# EAGLE design PCSoposeLM (EAGLE 9.6.2)

## Sheet 1 of 2
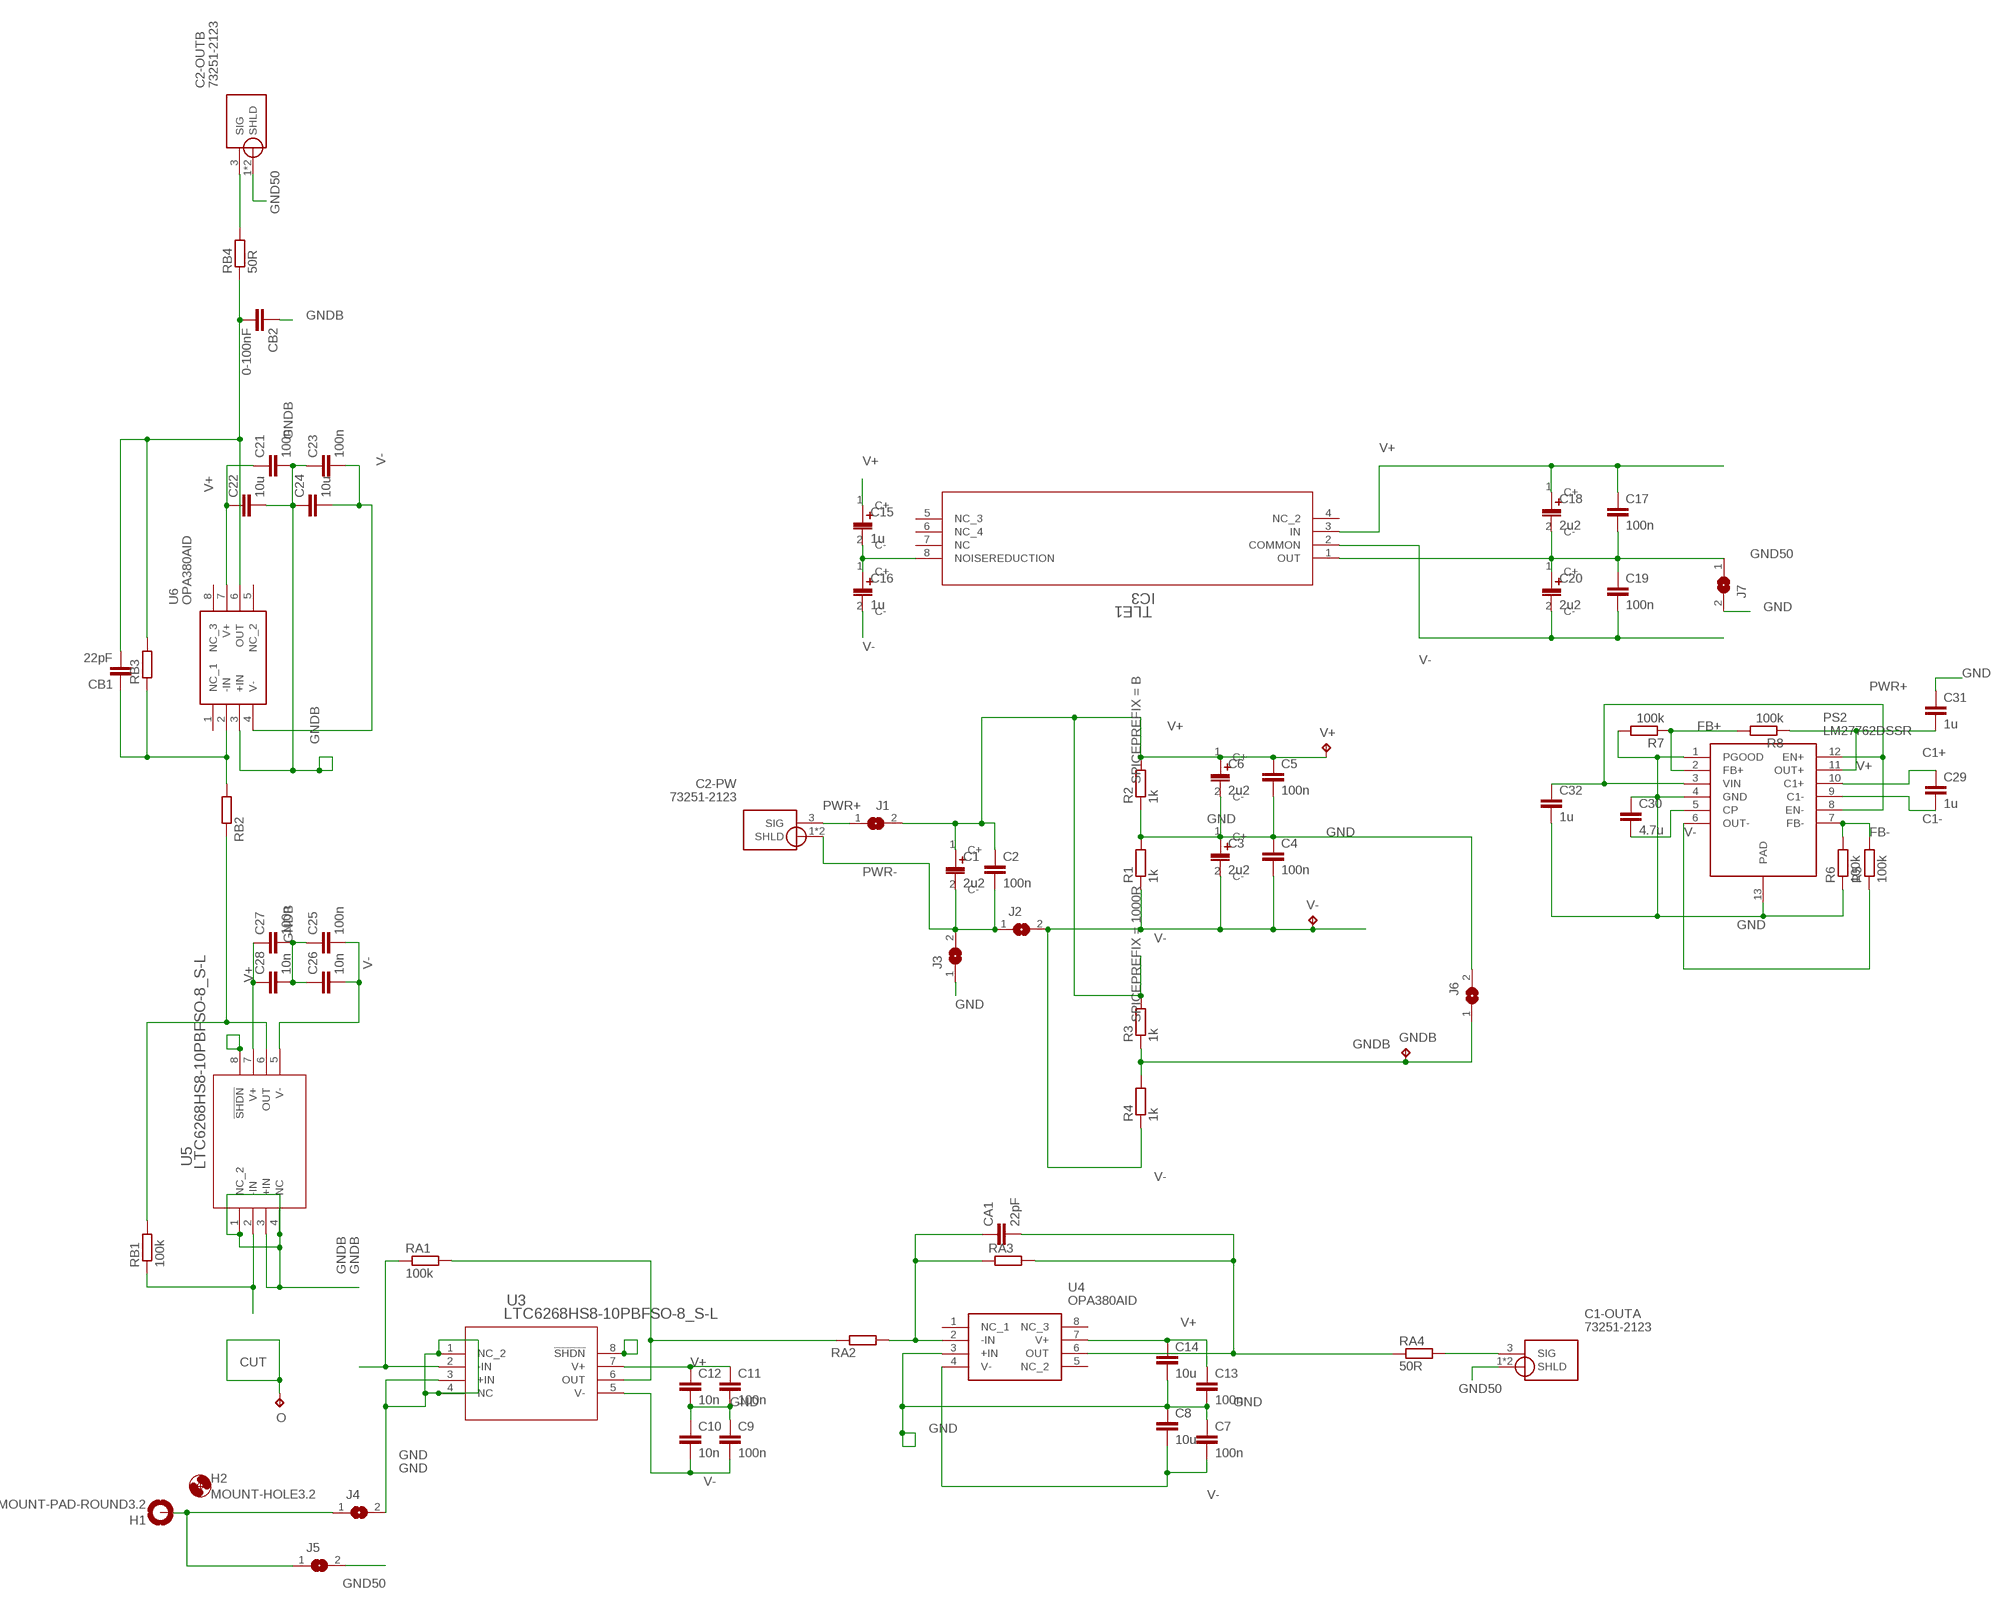
[diagram p0: schematic, sheet 1]

### Parts
C1  2u2  C-EU_POL  [C1206K]
C1-OUTA  73251-2123  [73251-2123]
C2  100n  C-EUC1206K  [C1206K]
C2-OUTB  73251-2123  [73251-2123]
C2-PW  73251-2123  [73251-2123]
C3  2u2  C-EU_POL  [C1206K]
C4  100n  C-EUC1206K  [C1206K]
C5  100n  C-EUC1206K  [C1206K]
C6  2u2  C-EU_POL  [C1206K]
C7  100n  C-EUC1206K  [C1206K]
C8  10u  C-EUC1206K  [C1206K]
C9  100n  C-EUC1206K  [C1206K]
C10  10n  C-EUC1206K  [C1206K]
C11  100n  C-EUC1206K  [C1206K]
C12  10n  C-EUC1206K  [C1206K]
C13  100n  C-EUC1206K  [C1206K]
C14  10u  C-EUC1206K  [C1206K]
C15  1u  C-EU_POL  [C1206K]
C16  1u  C-EU_POL  [C1206K]
C17  100n  C-EUC1206K  [C1206K]
C18  2u2  C-EU_POL  [C1206K]
C19  100n  C-EUC1206K  [C1206K]
C20  2u2  C-EU_POL  [C1206K]
C21  100n  C-EUC1206K  [C1206K]
C22  10u  C-EUC1206K  [C1206K]
C23  100n  C-EUC1206K  [C1206K]
C24  10u  C-EUC1206K  [C1206K]
C25  100n  C-EUC1206K  [C1206K]
C26  10n  C-EUC1206K  [C1206K]
C27  100n  C-EUC1206K  [C1206K]
C28  10n  C-EUC1206K  [C1206K]
C29  1u  C-EUC1206K  [C1206K]
C30  4.7u  C-EUC1206K  [C1206K]
C31  1u  C-EUC1206K  [C1206K]
C32  1u  C-EUC1206K  [C1206K]
CA1  22pF  C-EUC1206K  [C1206K]
CB1  22pF  C-EUC1206K  [C1206K]
CB2  0-100nF  C-EUC1206K  [C1206K]
GNDB  TPB2,54  [B2,54]
H1  MOUNT-PAD-ROUND3.2  [3,2-PAD]
H2  MOUNT-HOLE3.2  [3,2]
J1  SJ  [SJ]
J2  SJ  [SJ]
J3  SJ  [SJ]
J4  SJ  [SJ]
J5  SJ  [SJ]
J6  SJ  [SJ]
J7  SJ  [SJ]
O  TPTP06R  [TP06R]
PS2  LM27762DSSR  [SON50P200X300X80-13N]
R1  1k  R-EU_R1206  [R1206]
R2  1k  R-EU_R1206  [R1206]
R3  1k  R-EU_R1206  [R1206]
R4  1k  R-EU_R1206  [R1206]
R5  100k  R-EU_R0805  [R0805]
R6  100k  R-EU_R0805  [R0805]
R7  100k  R-EU_R0805  [R0805]
R8  100k  R-EU_R0805  [R0805]
RA1  100k  R-EU_R1206  [R1206]
RA2  R-EU_R1206  [R1206]
RA3  R-EU_R1206  [R1206]
RA4  50R  R-EU_R1206  [R1206]
RB1  100k  R-EU_R1206  [R1206]
RB2  R-EU_R1206  [R1206]
RB3  R-EU_R1206  [R1206]
RB4  50R  R-EU_R1206  [R1206]
TLE1  IC3  TLE2426CDD8-M  [D8-M]
U3  LTC6268HS8-10PBFSO-8_S-L  [SO-8_S-L]
U4  OPA380AID  [SOIC127P600X175-8N]
U5  LTC6268HS8-10PBFSO-8_S-L  [SO-8_S-L]
U6  OPA380AID  [SOIC127P600X175-8N]
V+  TPB2,54  [B2,54]
V-  TPB2,54  [B2,54]

### Nets
C1+: C29.1 PS2.10(C1+)
C1-: C29.2 PS2.9(C1-)
CUT: O.TP
EXTGND: H1.B3,2(MOUNT) J4.1 J5.1
FB+: PS2.2(FB+) R7.1 R8.2
FB-: PS2.7(FB-) R5.2 R6.2
GND [Supply]: C3.1(C+) C4.1 C5.2 C6.2(C-) C7.1 C8.1 C9.1 C10.1 C11.2 C12.2 C13.2 C14.2 C30.1 C31.1 C32.2 J3.1 J4.2 J6.2 J7.2 PS2.1(PGOOD) PS2.4(GND) PS2.13(PAD) R1.2 R2.1 R6.1 R7.2 U3.1(NC_2) U3.3(+IN) U3.4(NC) U4.3(+IN)
GND50 [Signal]: C1-OUTA.1(SHLD) C1-OUTA.2(SHLD) C2-OUTB.1(SHLD) C2-OUTB.2(SHLD) C17.2 C18.2(C-) C19.1 C20.1(C+) J5.2 J7.1 TLE1.1(OUT)
GNDB [Supply]: C21.2 C22.2 C23.1 C24.1 C25.1 C26.1 C27.2 C28.2 CB2.1 GNDB.TP J6.1 R3.1 R4.2 U5.1(NC_2) U5.3(+IN) U5.4(NC) U6.3(+IN)
INA [Signal]: RA1.1 U3.2(-IN)
INB [Signal]: RB1.1 U5.2(-IN)
N$1: U3.8(!SHDN)
N$4: C15.2(C-) C16.1(C+) TLE1.8(NOISEREDUCTION)
N$8 [Signal]: RA1.2 RA2.2 U3.6(OUT)
N$9: C30.2 PS2.5(CP)
N$10 [Signal]: CA1.1 RA2.1 RA3.1 U4.2(-IN)
N$11 [Signal]: CA1.2 RA3.2 RA4.1 U4.6(OUT)
N$12 [50Ohm TOP-L2]: C1-OUTA.3(SIG) RA4.2
N$16 [Signal]: RB1.2 RB2.2 U5.6(OUT)
N$18 [Signal]: CB1.1 RB2.1 RB3.1 U6.2(-IN)
N$19 [Signal]: CB1.2 CB2.2 RB3.2 RB4.1 U6.6(OUT)
N$20 [50Ohm TOP-L2]: C2-OUTB.3(SIG) RB4.2
N$21: U5.8(!SHDN)
PWR+ [Supply]: C2-PW.3(SIG) C32.1 J1.1 PS2.3(VIN) PS2.8(EN-) PS2.12(EN+)
PWR-: C1.2(C-) C2-PW.1(SHLD) C2-PW.2(SHLD) C2.2 J2.1 J3.2
V+ [Supply]: C1.1(C+) C2.1 C5.1 C6.1(C+) C11.1 C12.1 C13.1 C14.1 C15.1(C+) C17.1 C18.1(C+) C21.1 C22.1 C27.1 C28.1 C31.2 J1.2 PS2.11(OUT+) R2.2 R3.2 R8.1 TLE1.3(IN) U3.7(V+) U4.7(V+) U5.7(V+) U6.7(V+) V+.TP
V- [Supply]: C3.2(C-) C4.2 C7.2 C8.2 C9.2 C10.2 C16.2(C-) C19.2 C20.2(C-) C23.2 C24.2 C25.2 C26.2 J2.2 PS2.6(OUT-) R1.1 R4.1 R5.1 TLE1.2(COMMON) U3.5(V-) U4.4(V-) U5.5(V-) U6.4(V-) V-.TP
Unconnected: TLE1.4(NC_2) TLE1.5(NC_3) TLE1.6(NC_4) TLE1.7(NC) U4.1(NC_1) U4.5(NC_2) U4.8(NC_3) U6.1(NC_1) U6.5(NC_2) U6.8(NC_3)

## Sheet 2 of 2

## Library data of the parts
C1 C3 C6 C15 C16 C18 C20 = SMA-NEU:C-EU_POL; SPICEPREFIX: C
C1-OUTA C2-OUTB C2-PW = SMA-NEU:73251-2123: SMA Jack PCB Edge Mount 50 no hardware Molex Straight 50 Edge Mount Bulkhead Fitting SMA Connector, jack, Solder Termination Source: Datasheet <http://uk.rs-online.com/web/p/products/8006949>; DESCRIPTION: SMA Jack PCB Edge Mount 50 no hardware Molex Straight 50 Edge Mount Bulkhead Fitting SMA Connector, jack, Solder Termination; HEIGHT: mm; MANUFACTURER_NAME: Molex; MANUFACTURER_PART_NUMBER: 73251-2123; RS_PART_NUMBER: 8006949; RS_PRICE-STOCK: http://uk.rs-online.com/web/p/products/8006949
C2 C4 C5 C7-C14 C17 C19 C21-C32 CA1 CB1 CB2 = rcl:C-EU: CAPACITOR, European symbol; SPICEPREFIX: C
GNDB O = testpad:TP: Test pad
H1 = holes:MOUNT-PAD-ROUND: MOUNTING PAD, round
H2 = holes:MOUNT-HOLE: MOUNTING HOLE with drill center marker
J1-J7 = jumper:SJ: SMD solder JUMPER
PS2 = SamacSys_Parts:LM27762DSSR: LDO Voltage Regulators Low-Noise Positive- and Negative-Output Integrated Switched Capacitor Plus LDO 12-WSON -40 to 85 Source: Datasheet <https://www.ti.com/lit/ds/symlink/lm27762.pdf>; DESCRIPTION: LDO Voltage Regulators Low-Noise Positive- and Negative-Output Integrated Switched Capacitor Plus LDO 12-WSON -40 to 85; HEIGHT: 0.8mm; MANUFACTURER_NAME: Texas Instruments; MANUFACTURER_PART_NUMBER: LM27762DSSR; MOUSER_PART_NUMBER: 595-LM27762DSSR; MOUSER_PRICE-STOCK: https://www.mouser.co.uk/ProductDetail/Texas-Instruments/LM27762DSSR?qs=vcbl%252BK4rRlfEJcC9xQ80sA%3D%3D
R1 R2 = rcl:R-EU_: RESISTOR, European symbol; SPICEPREFIX: B
R3 R4 = rcl:R-EU_: RESISTOR, European symbol; SPICEPREFIX: 1000R
R5-R8 RA1-RA4 RB1-RB4 = rcl:R-EU_: RESISTOR, European symbol; SPICEPREFIX: R
TLE1 = TLE2426CD:TLE2426CD; COPYRIGHT: Copyright (C) 2023 Ultra Librarian. All rights reserved.; MANUFACTURER_PART_NUMBER: TLE2426CD; MFR_NAME: Texas Instruments
U3 U5 = LTC6268:LTC6268HS8-10PBF; MANUFACTURER_PART_NUMBER: ltc6268hs8-10#pbf; VENDOR: Linear Technology
U4 U6 = SamacSys_Parts:OPA380AID: Texas Instruments OPA380AID, Transimpedance Amplifier 3 V, 5 V 90MHz 8-Pin SOIC Source: Datasheet <http://uk.rs-online.com/web/p/products/6612498P>; DESCRIPTION: Texas Instruments OPA380AID, Transimpedance Amplifier 3 V, 5 V 90MHz 8-Pin SOIC; HEIGHT: 1.75mm; MANUFACTURER_NAME: Texas Instruments; MANUFACTURER_PART_NUMBER: OPA380AID; RS_PART_NUMBER: 6612498P; RS_PRICE-STOCK: http://uk.rs-online.com/web/p/products/6612498P
V+ V- = testpad:TP: Test pad; SPICEPREFIX: X

## Net classes
0 default: width 0.254 mm, clearance 0.205 mm
1 Supply: width 0.254 mm, clearance 0.205 mm to class 0, clearance 0.205 mm
2 Signal: width 0.254 mm, clearance 0.381 mm to class 0, clearance 0.381 mm to class 1, clearance 0.381 mm
3 50Ohm TOP-L2: width 0.245 mm, clearance 1 mm to class 0, clearance 2 mm to class 1, clearance 1 mm to class 2, clearance 1 mm

## Board
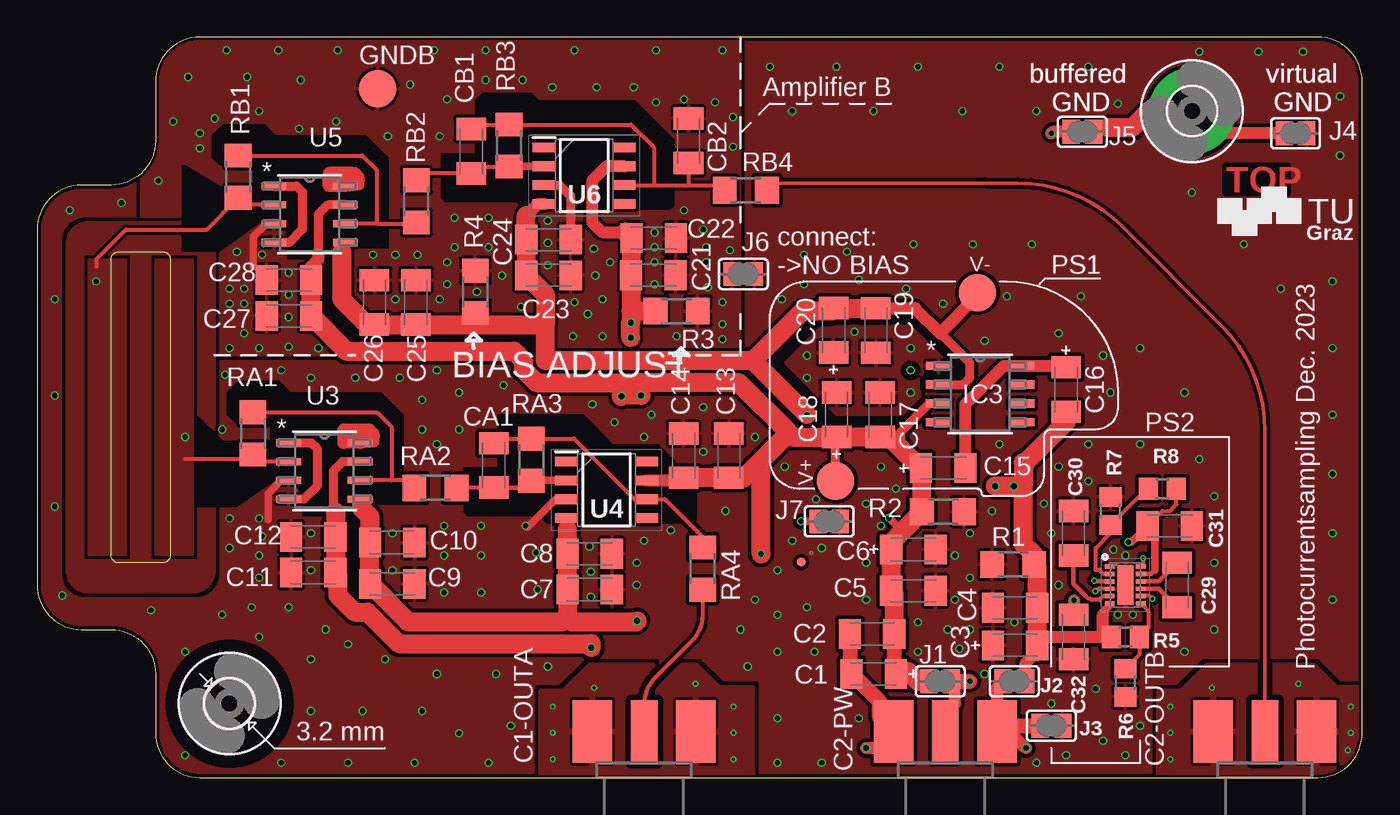
[diagram p1: board, top side]
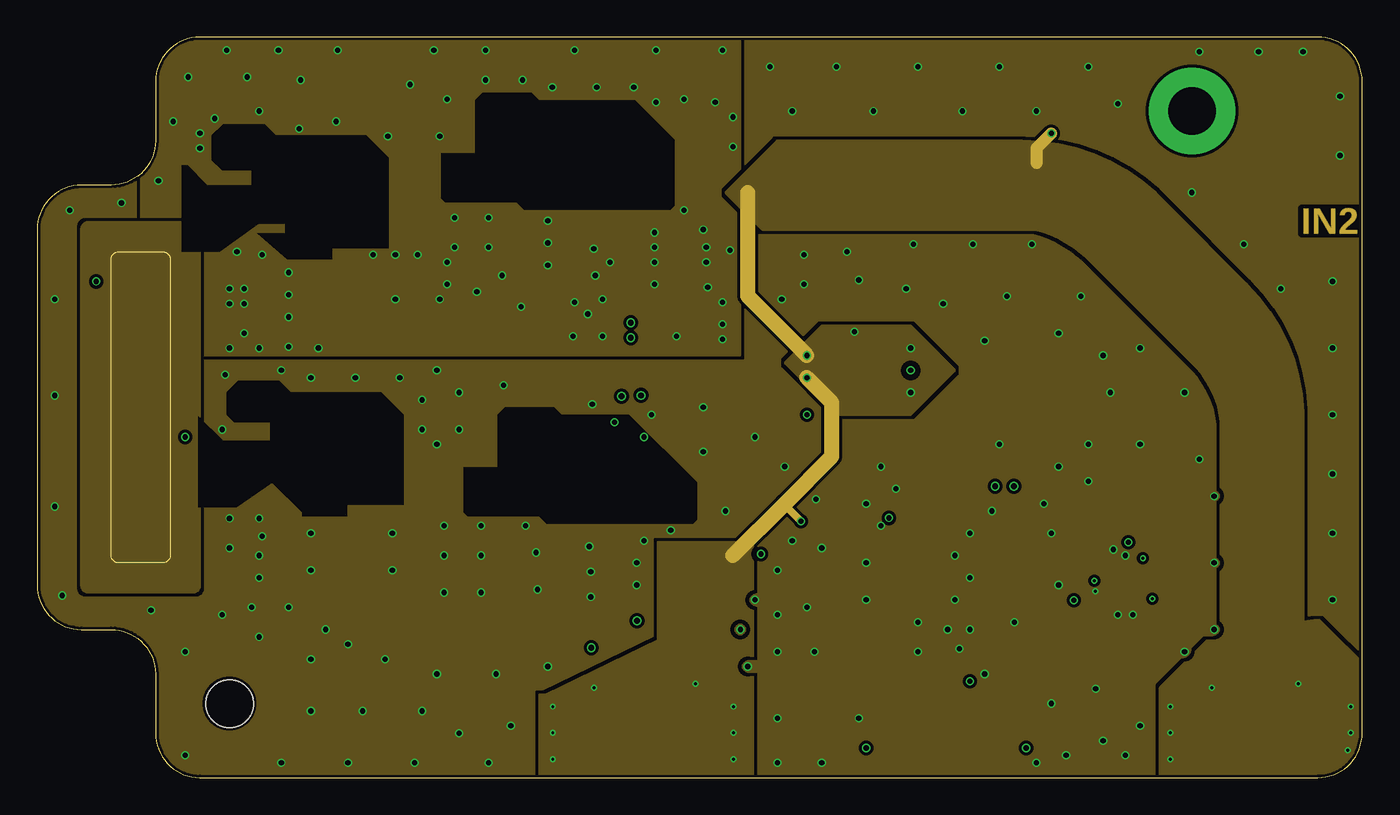
[diagram p2: board, inner layer Route2]
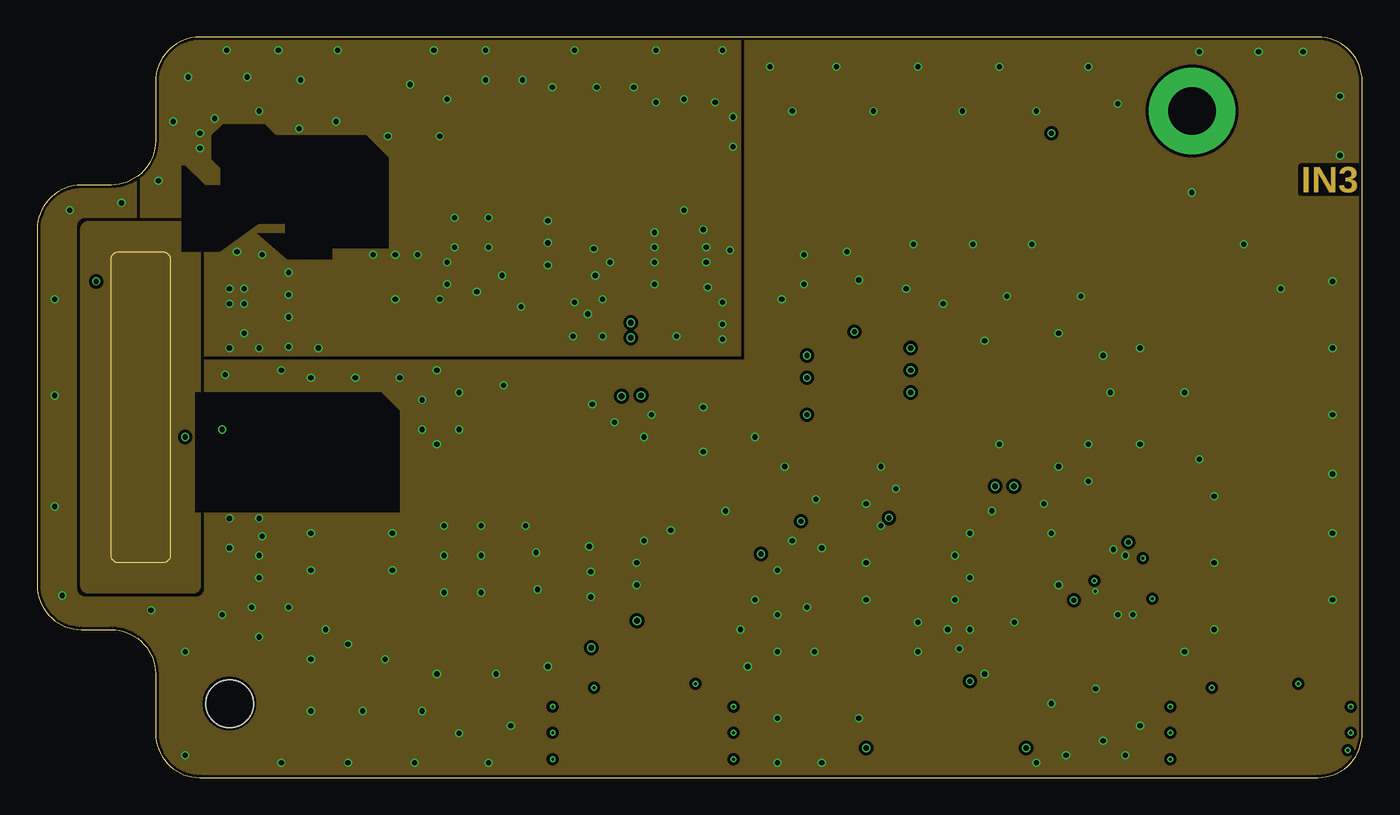
[diagram p3: board, inner layer Route3]
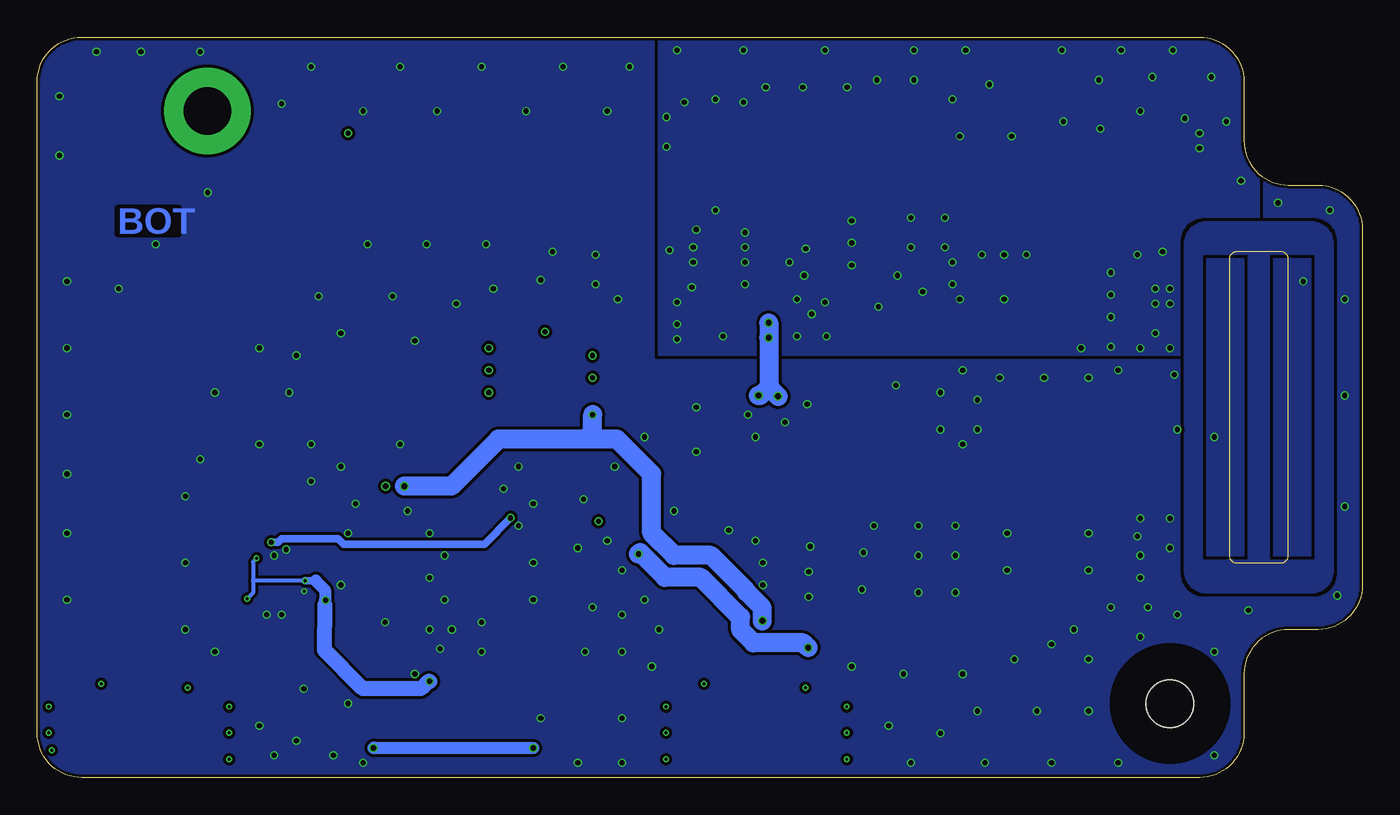
[diagram p4: board, bottom side, seen from below]

Size 89.5 x 50 mm. Coordinates in mm from the lower left corner, seen from the top.
Outline: 8,7 8,3 arc90 11,0 86.5,0 arc90 89.5,3 89.5,47 arc90 86.5,50 11,50 arc90 8,47 8,43 arc-90 5,40 3,40 arc90 0,37 0,13 arc90 3,10 5,10 arc-90 8,7
Copper layers (1+2*3+16): Top 0.018mm / dielectric 0.36mm / Route2 0.035mm / dielectric 0.71mm / Route3 0.035mm / dielectric 0.36mm / Bottom 0.018mm
Design rules "Multi-CB_4L_100µm-Tracks_OL35µm-IL35µm *": minimum track width 0.1mm, minimum drill 0.2mm, track to track 0.1mm, track to pad 0.1mm, pad to pad 0.1mm, via to via 0.1mm, smd to smd 0mil, copper to edge 0.2mm, drill to drill 0.2mm, minimum pad ring 0.125mm, minimum via ring 0.1mm, stop-mask expansion 2mil, vias tented up to drill 0.45mm, thermal gap 0.2mm
Milling: 8 lines

### Footprints (pad centres in the part's own frame; a part is rotated, then mirrored left to right if it is on the bottom)
C1206K = smd 1.5 x 2: 1 -1.5,0; 2 1.5,0
73251-2123 = smd 2.665 x 4.19: 1 -3.493,-3.115; 2 3.493,-3.115 | smd 1.78 x 4.19: 3 0,-3.115
B2,54 = smd 2.54 x 2.54: TP 0,0
3,2-PAD = drill 3.2 pad 5.842: B3,2 0,0
3,2 = hole 3.2: 0,0
SJ = smd 1.168 x 1.6: 1 -0.762,0; 2 0.762,0
TP06R = smd 0.6 x 0.6: TP 0,0
SON50P200X300X80-13N = smd 0.65 x 0.3: 1 -1.05,1.25; 2 -1.05,0.75; 3 -1.05,0.25; 4 -1.05,-0.25; 5 -1.05,-0.75; 6 -1.05,-1.25; 7 1.05,-1.25; 8 1.05,-0.75; 9 1.05,-0.25; 10 1.05,0.25; 11 1.05,0.75; 12 1.05,1.25 | smd 1.1 x 2.66: 13 0,0
R1206 = smd 1.6 x 1.803: 1 -1.422,0; 2 1.422,0
R0805 = smd 1.3 x 1.5: 1 -0.95,0; 2 0.95,0
D8-M = smd 1.664 x 0.559: 1 -2.826,1.905; 2 -2.826,0.635; 3 -2.826,-0.635; 4 -2.826,-1.905; 5 2.826,-1.905; 6 2.826,-0.635; 7 2.826,0.635; 8 2.826,1.905
SO-8_S-L = smd 1.676 x 0.483: 1 -2.413,1.905; 2 -2.413,0.635; 3 -2.413,-0.635; 4 -2.413,-1.905; 5 2.413,-1.905; 6 2.413,-0.635; 7 2.413,0.635; 8 2.413,1.905
SOIC127P600X175-8N = smd 1.528 x 0.65: 1 -2.711,1.905; 2 -2.711,0.635; 3 -2.711,-0.635; 4 -2.711,-1.905; 5 2.711,-1.905; 6 2.711,-0.635; 7 2.711,0.635; 8 2.711,1.905

### Placement (x,y rotation side)
C1  56.5,7 180 top
C1-OUTA  41,0 180 top
C2  56.4,9.69 180 top
C2-OUTB  82.93,0 180 top
C2-PW  61.34,0 180 top
C3  66.05,8.93 0 top
C4  66.05,11.47 0 top
C5  59.19,12.61 0 top
C6  59.19,15.41 0 top
C7  37.32,12.7 180 top
C8  37.32,15.11 180 top
C9  23.99,13.08 180 top
C10  23.99,15.87 180 top
C11  18.65,13.84 180 top
C12  18.65,16.25 180 top
C13  46.73,21.74 90 top
C14  43.67,21.74 90 top
C15  61.2,20.9 0 top
C16  69.5,26.2 270 top
C17  56.94,24.49 90 top
C18  54,24.5 90 top
C19  56.65,30.19 90 top
C20  53.8,30.2 90 top
C21  41.62,33.92 0 top
C22  41.66,36.42 0 top
C23  34.54,33.91 180 top
C24  34.54,36.32 180 top
C25  25.59,32.09 270 top
C26  22.8,32.09 270 top
C27  17.02,31.17 180 top
C28  17.02,33.59 180 top
C29  77,13 270 top
C30  70,16.5 270 top
C31  76.5,17 180 top
C32  70,9.5 270 top
CA1  30.85,21.08 90 top
CB1  29.34,42.29 90 top
CB2  44,43 270 top
GNDB  23,46.5 0 top
H1  78,45 0 top
H2  13,5 0 top
J1  61,6.5 180 top
J2  66,6.5 0 top
J3  68.5,3.5 180 top
J4  85,43.5 0 top
J5  70.6,43.6 180 top
J6  47.7,34 0 top
J7  53.5,17.3 0 top
O  51.6,14.55 270 top
PS2  73.5,13 0 top
R1  65.92,14.39 180 top
R2  61.19,17.95 180 top
R3  43.2,31.5 180 top
R4  29.6,32.8 90 top
R5  73.5,9.5 0 top
R6  73.5,6.4 90 top
R7  72.5,18 90 top
R8  76,19.5 180 top
RA1  14.59,23.24 90 top
RA2  26.91,19.56 180 top
RA3  33.39,21.46 90 top
RA4  44.95,14.11 270 top
RB1  13.59,40.57 90 top
RB2  25.61,38.91 270 top
RB3  31.88,42.67 90 top
RB4  47.88,39.66 0 top
TLE1  63.69,25.9 0 top
U3  19.42,20.7 0 top
U4  38.47,19.43 0 top
U5  18.42,38.03 0 top
U6  36.96,40.64 0 top
V+  53.94,20.03 270 top
V-  63.53,32.74 270 top

### Tracks (layer width: path | path; a pad name or v marks a point on that pad's centre or on a via)
C1+
  Top 0.305: PS2.10 75.75,13.25 C29.1
C1-
  Top 0.254: PS2.9 74.55,12.77
  Top 0.305: PS2.9 75.75,12.75 C29.2
CUT
  pour Top (rank 2): 3.5,37.5 10.5,37.5 arc-90 12,36 12,14 arc-90 10.5,12.5 3.5,12.5 arc-90 2,14 2,36 arc-90
  pour Route2: 3.5,37.5 10.5,37.5 arc-90 11,37 11,13 arc-90 10.5,12.5 3.5,12.5 arc-90 3,13 3,37 arc-90
  pour Route3 (rank 2): 3.5,37.5 10.5,37.5 arc-90 11,37 11,13 arc-90 10.5,12.5 3.5,12.5 arc-90 3,13 3,37 arc-90
  pour Bottom (rank 2): 3.5,37.5 10.5,37.5 arc-90 12,36 12,14 arc-90 10.5,12.5 3.5,12.5 arc-90 2,14 2,36 arc-90
EXTGND
  Top 0.813: 72.31,43.88 71.65,43.88 J5.1 | J4.1 79.5,43.5
  Top 1.27: 72.31,43.88 73.96,43.88 75.08,45 H1.B3,2 79.5,43.5
FB+
  Top 0.254: PS2.2 72.05,13.75 72.03,13.77 71.99,13.77 71.75,14.01 71.5,14.01 71.5,15.5 72.5,16.5 R7.1 74.95,19.5 R8.2
FB-
  Top 0.254: PS2.7 75.05,11.25 75.05,10.1 R5.2 74.45,8.3 R6.2
GND  (via drill 0.2, 0.35)
  Top 0.254: PS2.4 71.65,12.75 v71.48,12.58
  Top 0.508: 15.61,17.4 15.61,19.18 16.49,20.07 U3.3 | 33.13,16.89 35.04,18.8 U4.3
  Top 0.61: U3.1 18.53,22.61 18.91,22.22 18.91,19.68 18.02,18.8 U3.4
  other vias: 51,45 57,21 12.5,11 30,15 14.5,11.5 63,16.5 18.5,27 26,25.5 27,22.5 28.5,26 31.5,26.5 37.5,25.2 41.5,24.5 52.6,18.8 56,18.5 50,14 53,15.5 58,19.5 56,14.5 56,12 57,17 52.5,8.5 40.5,14.5 41,16 40.5,13 42.8,16.7 27.5,12.5 27.5,15 27.5,17 30,17 30,12.5 33.8,12.7 33.7,15.2 33,17 15.2,16.3 13,15.5 23.5,8 15,15 15,13.5 17,11.5 21,9 15,9.5 25.5,1 26,4.5 21,1 10,1.5 10,8.5 18.5,8 13,17.5 54,48 56.5,45 59.5,48 65,48 71,48 78.5,49 82.5,49 85.5,49 62.5,45 67.5,45 73,45.5 64.5,18 62,15 63,13.5 62,12 63,10 59.5,10.5 61.5,10 62.3,8.7 64,7 48,7.5 59.5,8.5 71,22.5 69,21 68,18.5 68.5,16.5 70.5,32.5 65.5,32.5 19.5,10 18.5,4.5 16.5,1 22,4.5 27,7 34.5,7.5 31,7 32,3.5 30.5,1 28.5,3 49.5,48 50,1 50,4 50,8.5 52,11.5 51,16 50.5,21 46.5,18 26,23.5 27,27.5 24.5,27 21.5,27 16.5,27.5 12.7,27.2 12.5,23.5 28.5,23.5 39,24 41,23 45,25 45,22 48.5,23 37.4,13.9 37.3,15.6 37.4,12.2 24,14 24,16.5 55.5,4 69.5,1.5 74.5,3.5 67.5,1 68.5,5 77.5,8.5 71.5,6 79.5,10 69,13 73.5,15 79.5,14.5 79.5,19 78.5,21.5 77.5,26 72.5,26 72,28.5 74.5,29 64,29.5 69,30 50.3,32.3 51.8,33.3 51.8,35.3 55.5,33.6 54.7,35.5 58.7,33 59.2,36 61.2,32 63.2,36 67.2,36 87.5,12 87.5,16.5 87.5,20.5 87.5,24.5 87.5,29 87.5,33.5 88,46 88,42 84,33 81.5,36 78,39.5 18.5,14 18.5,16.5 15,17.5 7.7,11.3 1.7,12.3 1.2,18.3 1.2,25.8 1.2,32.3 2.2,38.3 5.7,38.8 65,22.5 73,11 74,11 72.7,15.4 50,11 47.5,10 74.5,22.5 73.5,1.5 53,1 48.5,12 66,10.5 72,2.5 71,20
  cutout Top: 28.81,20.95 31.1,20.95 31.1,24.51 31.11,24.52 36.91,24.52 38.92,22.51 41.99,22.51 44.56,19.94 44.56,17.4 44.31,17.14 34.4,17.14 33.89,17.65 29.07,17.65 28.81,17.91
  cutout Top: 10.9,18.26 10.9,24.39 12.56,22.73 15.73,22.73 15.73,24 13.32,24 12.81,24.51 12.81,26.03 13.57,26.8 16.37,26.8 17.13,26.03 23.23,26.03 24.75,24.51 24.75,18.41 20.94,18.41 20.94,17.65 17.89,17.65 17.89,19.21 16.65,20.45 13.49,18.26
  cutout Route3: 10.68,26.03 10.68,17.91 24.5,17.91 24.5,24.76 23.23,26.03
  cutout Top: 27.3,42.16 29.59,42.16 29.59,45.72 30.1,46.23 33.4,46.23 33.91,45.72 40.38,45.72 43.05,43.05 43.05,38.61 42.8,38.35 32.89,38.35 32.38,38.86 27.56,38.86 27.3,39.12
  cutout Top: 14.57,41.32 12.32,41.33 11.81,41.84 11.81,43.36 12.57,44.13 15.37,44.13 16.13,43.36 22.23,43.36 23.75,41.84 23.75,35.74 19.94,35.74 19.94,34.98 16.89,34.98 16.77,36.76 16.77,37.4 14.97,37.41 12.32,35.49 9.78,35.49 9.78,41.33 10.03,41.33 14.53,38.66
  pour Top (isolate 0.254, rank 6): -10.39,-12.06 -10.39,68.9 110.23,68.9 110.23,-12.06
  pour Bottom (rank 6): -4,-4.5 96,-4.5 96,60 -4,60
  pour Route2 (rank 6): -8,-8.5 106,-8.5 106,65.5 -8,65.5
  pour Route3 (rank 6): -6,-6.5 99.5,-6.5 99.5,63.5 -6,63.5
  cutout Route2: 10.9,18.26 10.9,24.39 12.56,22.73 15.73,22.73 15.73,24 13.32,24 12.81,24.51 12.81,26.03 13.57,26.8 16.37,26.8 17.13,26.03 23.23,26.03 24.75,24.51 24.75,18.41 20.94,18.41 20.94,17.65 17.89,17.65 17.89,17.91 15.88,19.91 13.49,18.26
  cutout Route2: 28.81,20.95 31.1,20.95 31.1,24.51 31.61,25.02 34.91,25.02 35.42,24.51 39.99,24.51 44.56,19.94 44.56,17.4 44.31,17.14 34.4,17.14 33.89,17.65 29.07,17.65 28.81,17.91
  cutout Route2: 14.5,40.99 12.5,40.99 11.81,41.69 11.81,43.36 12.57,44.13 15.37,44.13 16.13,43.36 22.23,43.36 23.75,41.84 23.75,35.74 19.94,35.74 19.94,34.98 16.89,34.98 14.86,36.76 16.77,36.76 16.77,37.4 14.97,37.41 12.32,35.49 9.78,35.49 9.78,41.33 10.17,41.33 11.5,40 14.5,40
  cutout Route3: 12.42,41.13 11.81,41.74 11.81,43.36 12.57,44.13 15.37,44.13 16.13,43.36 22.23,43.36 23.75,41.84 23.75,35.74 19.94,35.74 19.94,34.98 16.89,34.98 14.86,36.76 16.77,36.76 16.77,37.4 14.97,37.41 12.32,35.49 9.78,35.49 9.78,41.3 10,41.3 11.35,40 12.41,40
  cutout Route2: 27.3,42.16 29.59,42.16 29.59,45.72 30.1,46.23 33.4,46.23 33.91,45.72 40.38,45.72 43.05,43.05 43.05,38.61 42.8,38.35 32.89,38.35 32.38,38.86 27.56,38.86 27.3,39.12
GND50  (via drill 0.2, 0.35)
  Top 0.508: J7.1 v51.6,17.3
  Top 0.813: J5.2 68.6,43.6 v68.5,43.5
  Route2 0.508: v51.6,17.3 50.5,18.4 50.5,18.5
  Route2 0.813: v68.5,43.5 67.5,42.5 67.5,41.5
  Route2 1.016: v52,27 53.66,25.34 53.66,21.66 50.5,18.5 47,15 | v52,28.5 48,32.5 48,39.5
  other vias: 37.63,6.07 34.83,4.8 34.83,3.02 34.83,1.24 44.47,6.32 47.03,4.8 47.03,3.02 47.03,1.24 79.34,6.07 76.54,4.8 76.54,3.02 76.54,1.24 85.18,6.32 88.74,4.8 88.74,3.02 88.54,1.84 59,26 55.2,30.1 59,29
  pour Route2: 42,15.87 48.28,15.87 48.28,-0.14 34,-0.14 34,5.57 34.42,5.57 42,9.26
  pour Top: 34.07,5.82 35.6,5.82 37.37,7.59 44.49,7.59 46.01,6.07 48.3,6.07 48.3,0.23 34.07,0.23
  pour Top: 75.78,5.82 77.31,5.82 79.08,7.59 86.2,7.59 87.72,6.07 90.01,6.07 90.01,0.23 75.78,0.23
  pour Route2 (rank 2): 86.5,10.5 90,7 90,-1 76,-1 76,6 79.5,9.5
  pour Top: 50.5,28 53,30.5 59,30.5 62,27.5 59,24.5 54,24.5
  pour Route2: 50.5,28 53,30.5 59,30.5 62,27.5 59,24.5 54,24.5
  pour Route2 (isolate 0.254): 46.5,39.5 50,43 66.5,43 arc-48 76.4,38.6 81.68,33.32 arc-47 85.5,23.5 85.5,8 80,8 80,23.5 arc48 78,28 71,35 arc31 67.5,37 49,37
GNDB  (via drill 0.35)
  Top 0.508: U5.3 15.5,37.4 14.61,36.51 14.61,34.5
  Top 0.61: U6.3 35.3,40.01 36.04,39.27 C24.1 | U5.1 17.53,39.94 17.91,39.55 17.91,37.01 17.02,36.12 U5.4
  other vias: 11,42.5 11,43.5 12,44.5 15,45 17.7,43.8 20.2,44.3 10.2,47.3 14.2,47.3 25.2,46.8 23.7,43.3 28.2,35.8 37.2,31.3 43.2,29.8 43.7,45.8 9.2,44.3 8.2,40.3 36.2,29.8 38.2,29.8 37.6,35.7 37.7,33.9 38.2,32.3 36.3,32.1 38.7,34.8 41.7,33.3 41.7,34.8 41.7,35.8 41.7,36.8 43.7,38.3 45,37 45.2,35.8 45.2,34.8 45.3,33.1 46.3,32.1 46.3,30.6 46.3,29.6 46.8,35.6 47,42.6 47,44.6 45.8,45.6 41.8,45.6 40.3,46.6 37.8,46.6 34.8,46.6 32.8,47.1 30.3,47.1 36.3,49.1 41.8,49.1 46.3,49.1 30.3,49.1 26.8,49.1 17.8,47.1 20.3,49.1 16.3,49.1 12.8,49.1 27.2,43.3 27.7,45.8 25.7,35.3 22.7,35.3 24.2,35.3 27.7,34.8 27.7,33.3 27.2,32.3 24.2,32.3 28.2,37.8 30.5,37.8 32.7,31.8 29.7,32.8 31.4,33.9 30.5,35.8 34.5,34.6 34.5,36.1 34.5,37.6 15.2,35.3 17,34.1 17,32.6 17,31.1 17,29.1 13,29 15,29 19,29 14,30 14,32 14,33 13,32 13,33 13.5,35.5
  pour Top (rank 5): 47.5,29.5 47.5,52 7.5,52 7,52 7,29.5 7,28.5 47.5,28.5
  pour Route2 (rank 5): 47.5,29.5 47.5,52 7.5,52 7,52 7,29.5 7,28.5 47.5,28.5
  pour Route3 (rank 5): 47.5,29.5 47.5,52 7.5,52 7,52 7,29.5 7,28.5 47.5,28.5
  pour Bottom (rank 5): 47.5,29.5 47.5,52 7.5,52 7,52 7,29.5 7,28.5 47.5,28.5
INA  (via drill 0.35)
  Top 0.254: U3.2 15.07,21.34 RA1.1 14.27,21.5 10,21.5
  other vias: 10,23
  pour Top: 8,35 10.5,35 10.5,15 8,15
  pour Bottom: 8,35 10.5,35 10.5,15 8,15
INB  (via drill 0.35)
  Top 0.254: U5.2 14.07,38.66 RB1.1 11.44,37 6,37 4,35 4,34.5
  other vias: 4,33.5
  pour Top: 3.5,35 6,35 6,15 3.5,15
  pour Bottom: 3.5,35 6,35 6,15 3.5,15
N$1
  Top 0.813: 22.3,23.5 22.5,23.1 20.7,23.2 20.7,22.6 20.7,22.61 U3.8 22.7,22.7 22.72,23.22 22.44,23.5 22.3,23.5 | 22.3,23.5 20.7,23.5
N$4
  Top 0.813: C15.2 62.7,25.2 65.3,27.8 TLE1.8 69.4,27.8 C16.1
N$6  (via drill 0.35)
  other vias: 59,27.5
N$8
  Top 0.254: 23.93,20.07 24.98,20.07 RA2.2 | 23.93,20.07 U3.6 | RA1.2 22.97,24.66 23.93,23.69 23.93,20.07
N$9
  Top 0.254: PS2.5 72.43,12.23 71.99,12.23 71.75,12 71.22,12 71.14,12.08 71.02,12.08 70.85,12.25
  Top 0.305: C30.2 70,13.1 70.85,12.25
N$10
  Top 0.254: RA2.1 32.75,19.56 33.23,20.04 RA3.1 | CA1.1 32.88,19.58 33.36,20.07
  Top 0.508: 33.36,20.07 U4.2 33.41,20.07 RA3.1
N$11
  Top 0.254: 31.15,22.88 RA3.2 36.28,22.88 40.5,18.67 40.62,18.8 U4.6 42.4,18.8 45.75,15.45 45.03,15.45 RA4.1
  Top 0.813: CA1.2 31.15,22.88
N$12
  Top 0.254: RA4.2 44.95,11 arc-45 44.21,9.21 41.74,6.74 arc45 41,4.95 C1-OUTA.3
N$16
  Top 0.254: 22.93,37.4 U5.6 | RB1.2 21.97,41.99 22.93,41.02 22.93,37.4 | RB2.2 25.61,37.4 22.93,37.4
N$18
  Top 0.254: 31.83,41.25 31.85,41.27 RB3.1 31.83,41.25 | RB2.1 25.61,40.79 CB1.1 29.8,41.25 31.83,41.25
  Top 0.508: 31.85,41.27 U6.2
N$19
  Top 0.254: U6.6 41.66,40.01 | RB4.1 46.12,40 44,40 | 44,40 41.66,40 41.66,40.01 | 41.66,40.01 41.66,42.55 40.11,44.09 RB3.2 29.64,44.09 CB1.2 | CB2.2 44,40
N$20
  Top 0.245: RB4.2 49.78,40.14 64,40.14 64.07,40.14 66.22,40.14 arc-45 73.29,37.21 80,30.5 arc-45 82.93,23.43 C2-OUTB.3
N$21
  Top 0.813: 21.3,40.83 21.5,40.43 19.7,40.53 19.7,39.93 19.7,39.94 U5.8 21.7,40.03 21.72,40.55 21.44,40.83 21.3,40.83 | 21.3,40.83 19.7,40.83
PWR+  (via drill 0.2, 0.35)
  Top 0.254: v75.33,12.07 75.13,12.27 74.55,12.27 PS2.8 | v74.7,14.8 74.7,14.25 PS2.12
  Top 0.305: PS2.3 71.45,13.25 v71.4,13.3
  Top 0.813: C2-PW.3 61.34,4.34 62,5 62,6.26 J1.1 | C32.1 70,11.64 70.03,11.67 v70.03,11.97
  Top 1.016: J1.1 v63,6.5
  Bottom 0.254: v71.4,13.3 74.93,13.3 | 74.93,13.3 74.93,12.47 v75.33,12.07 | v74.7,14.8 74.93,14.57 74.93,13.3
  Bottom 0.508: 70.7,13.3 v71.4,13.3
  Bottom 0.813: 70.7,13.3 70.07,12.67 70.07,12 | 70.07,12 70.07,11.67 | v70.03,11.97 70.07,12
  Bottom 1.016: v63,6.5 63.1,6.5 63.59,6.01 67.51,6.01 70.1,8.6 70.07,11.67
PWR-  (via drill 0.35)
  Top 0.813: C2-PW.2 56.73,2 v56,2 | J2.1 64.83,6.09 C2-PW.1 65.69,3.12 v66.8,2
  Top 1.016: C2-PW.1 65.22,3.5 J3.2 | C2.2 54.9,7.1 | 54.9,7.1 C1.2 | C2-PW.2 56.9,4.07 56.9,5.15 54.95,7.1 54.9,7.1
  Bottom 0.813: v56,2 66.75,2 | 66.75,2 66.77,2.03 | v66.8,2 66.75,2
V+  (via drill 0.35, 0.4)
  Top 0.254: C31.2 76,18 76.5,18 76.95,18.45 R8.1
  Top 0.305: PS2.11 75.25,13.75 75.5,14
  Top 0.508: 75.5,14 75.5,16.5 C31.2 73.9,15.9 v73.7,15.9 | v57.53,17.53 58.41,16.66 58.41,16.59
  Top 0.61: U3.7 20.64,21.34 20,20.7 20,18.08 | U5.7 19.64,38.66 19,38.03 19,35.41 | 58.36,22.21 58.36,23.36 60.26,25.26 TLE1.3 | V+.TP 53.94,22.93 C18.1
  Top 0.813: U6.7 38.48,41.27 37.5,40.3 37.5,37.5 38.17,36.83 39.75,36.83 | 20,18.08 20.15,17.93 | C22.1 40.16,33.96 C21.1 | 19,35.41 19,35 18.5,34.5 18.5,33.6 C28.1 | U4.7 43.5,20.07 C14.1 | J1.2 59.5,6.5
  Top 1.016: C2.1 57.9,7.1 C1.1 58.15,7.15 58.85,7.15
  Top 1.27: C14.1 C13.1 47.74,20.24 48.5,21 | 20.15,17.93 C12.1 C11.1 20.3,13.69 20.3,12.32 21.45,11.18 22.31,11.18 24.44,9.04 37.44,9.04 v37.44,8.78 | C28.1 C27.1 20.89,28.8 32.2,28.8 32.86,28.14 32.86,27.53 33.72,26.67 40.38,26.67 | 50.77,23.27 47.37,26.67 40.38,26.67 | 39.75,36.83 40.12,36.47 C21.1 40.12,31.5 | 40.12,31.5 40.12,30.71 v40.1,30.7 | v40.1,29.7 40.1,30.8 | 40.38,26.67 39.47,25.75 v39.47,25.73 39.53,25.8 v40.8,25.8 | 48.5,21 50.77,23.27 | C2.1 57.9,12.41 C5.1 C6.1 57.69,15.87 58.41,16.59 R2.2 59.77,20.83 C15.1 59.67,20.9 58.36,22.21 57.58,22.99 C17.1 C18.1 | R3.2 40.12,31.5 | 50.77,23.27 51.05,22.99 C18.1 | v48.9,15.1 48.9,20.6 48.5,21 | 58.85,7.15 59.5,6.5
  Bottom 0.508: v73.7,15.9 73.24,15.9 73,16.13 69.17,16.13 68.8,15.77 59.3,15.77 v57.53,17.53
  Bottom 1.27: v40.1,30.7 v40.1,29.7 40.1,26.37 | 40.1,26.37 40.67,25.8 v40.8,25.8 | 40.1,26.37 v39.47,25.73 | v37.44,8.78 37.76,9.11 41.14,9.11 42.01,9.97 42.01,10.84 44.69,13.53 47.11,13.53 48.79,15.21 v48.9,15.1
V-  (via drill 0.35, 0.4)
  Top 0.254: PS2.6 72.45,11.64
  Top 0.508: U5.5 20.83,35.74 20.57,35.49 | 22.49,17.63 22.49,18.14 U3.5 | 35.82,16.74 35.82,17.46 U4.4 | C9.2 22.46,13.1 22.46,15.85 | C10.2 22.49,12.85 22.46,12.83 | 72,11 72,11.19 72.45,11.64 | 63.53,32.53 V-.TP
  Top 0.61: TLE1.2 62.53,26.53 63,27 63,28 61,30 | C20.2 53.8,31.64 53.66,31.5
  Top 0.813: 33.04,37.95 33.83,38.73 U6.4 | C19.2 59.31,31.69 61,30 63.53,32.53 | C3.2 67.55,9.5 R5.1 72,9.5 72,11 | 67.55,8.52 66.76,7.73 J2.2
  Top 1.27: 22.46,12.83 22.46,15.85 | 35.82,16.74 C8.2 C7.2 35.82,10.82 | C10.2 22.49,17.63 21.96,18.16 | 33.04,37.95 C24.2 C23.2 34.34,32.62 34.34,30.5 | 67.55,8.52 C3.2 C4.2 67.55,14.19 R1.1 67.34,15.04 66.62,15.77 66.62,19.68 | 66.62,19.68 66.62,21.29 66.79,21.29 69.5,24 C16.2 | 66.62,19.68 v65.98,19.68 v64.71,19.68 | 35.82,10.82 35.55,10.54 25.03,10.54 C9.2 | 35.82,10.82 36.12,10.52 40.47,10.52 v40.53,10.58 | 20.57,35.49 20.57,32.31 22.3,30.59 C26.2 C25.2 29.5,30.59 | 29.5,30.59 34.25,30.59 34.34,30.5 | v52,24.5 48.35,28.14 | 48.35,28.14 34.34,28.14 34.34,30.5 | 48.35,28.14 51.71,31.5 53.66,31.5 | R4.1 29.6,30.69 29.5,30.59 | C19.2 C20.2
  Bottom 1.27: v64.71,19.68 61.53,19.68 58.36,22.85 52.5,22.85 | 52.5,22.85 52,23.35 v52,24.5 | v40.53,10.58 40.53,11.45 41.62,12.54 41.62,12.62 44,15 46.5,15 48,16.5 48,20.5 50.35,22.85 52.5,22.85

### Text on the board
Top: TOP
Route2: IN2
Route3: IN3
Bottom: BOT
tNames: Amplifier B | buffered / GND | buffered / GND | buffered / GND | buffered / GND | virtual / GND | virtual / GND | virtual / GND | virtual / GND | TU | Graz | connect: / ->NO BIAS | PS1 | BIAS ADJUST | Photocurrentsampling Dec. 2023 | 3.2 mm